# Altium schematic sheet Power Board.DCDC2.SchDoc
size A4; SheetNumber: 2; SheetTotal: 2
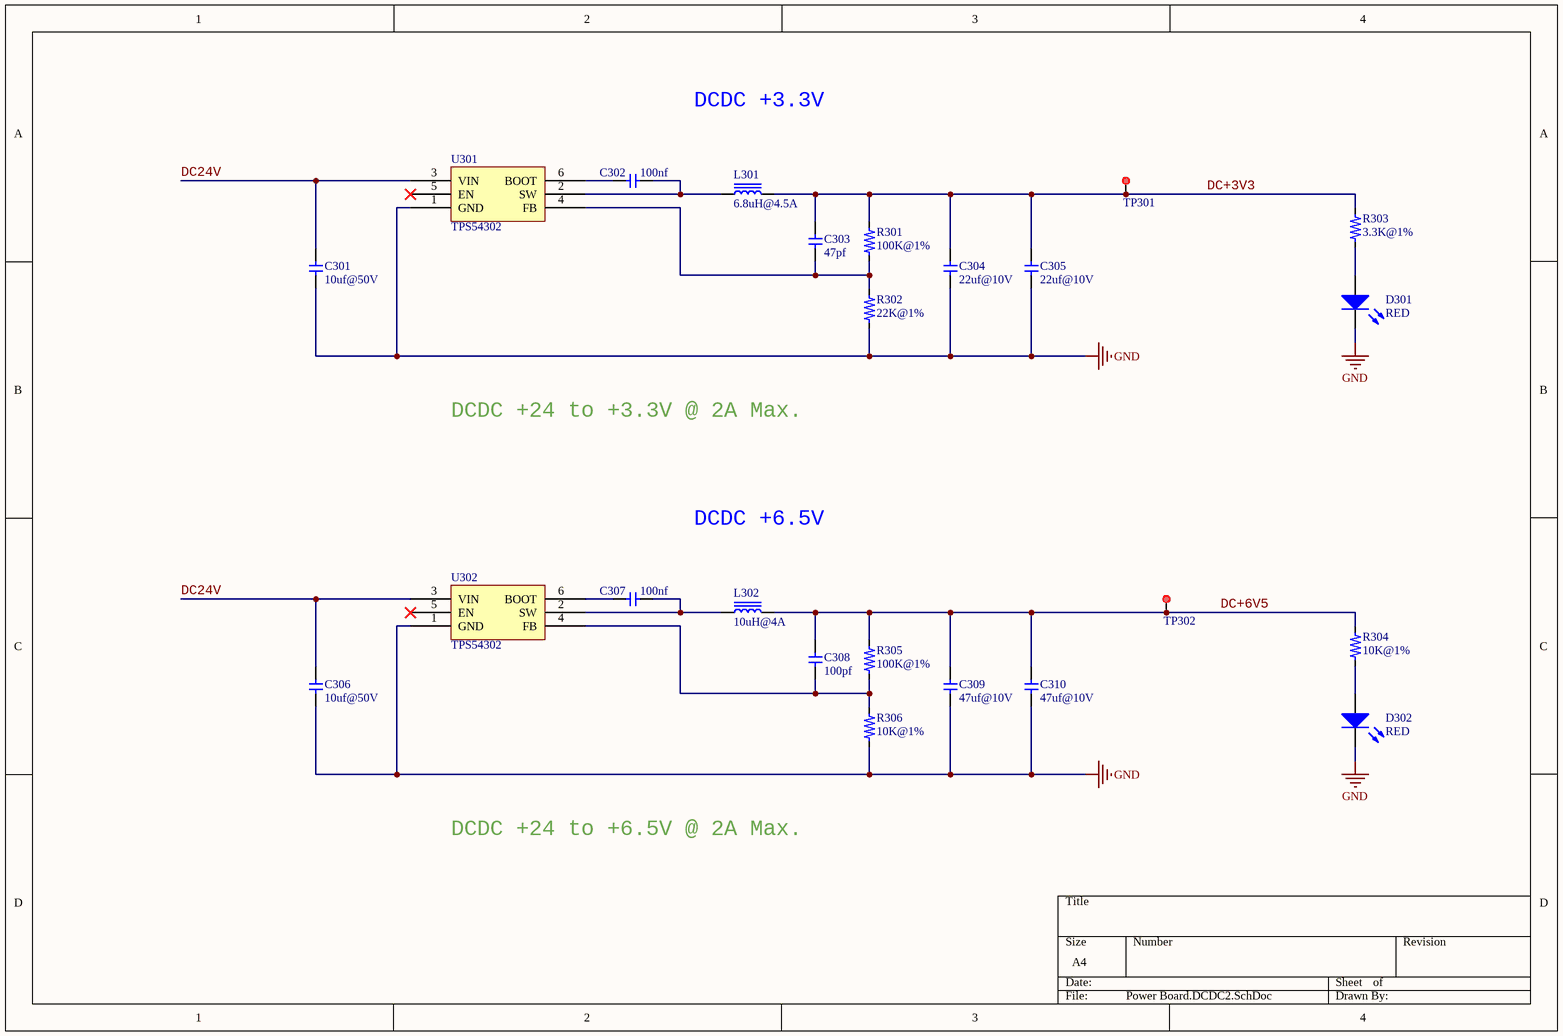
[diagram p0: Power Board.DCDC2.SchDoc]

## Parts
C301  value 10uf@50V  [C1206]  (hidden comment: Cap)
C302  value 100nf  [C0603]  (hidden comment: Cap)
C303  value 47pf  [C0603]  (hidden comment: Cap)
C304  value 22uf@10V  [C1206]  (hidden comment: Cap)
C305  value 22uf@10V  [C1206]  (hidden comment: Cap)
C306  value 10uf@50V  [C1206]  (hidden comment: Cap)
C307  value 100nf  [C0603]  (hidden comment: Cap)
C308  value 100pf  [C0603]  (hidden comment: Cap)
C309  value 47uf@10V  [C1206]  (hidden comment: Cap)
C310  value 47uf@10V  [C1206]  (hidden comment: Cap)
D301  value RED  [LED0603]  (hidden comment: LED)
D302  value RED  [LED0603]  (hidden comment: LED)
L301  value 6.8uH@4.5A  [L06063]  (hidden comment: Inductor Iron)
L302  value 10uH@4A  [L06063]  (hidden comment: Inductor Iron)
R301  value 100K@1%  [R0603]  (hidden comment: Res)
R302  value 22K@1%  [R0603]  (hidden comment: Res)
R303  value 3.3K@1%  [R0603]  (hidden comment: Res)
R304  value 10K@1%  [R0603]  (hidden comment: Res)
R305  value 100K@1%  [R0603]  (hidden comment: Res)
R306  value 10K@1%  [R0603]  (hidden comment: Res)
TP301  TestPoint  [TestPoint-THM1.0-L]  (value not drawn)
TP302  TestPoint  [TestPoint-THM1.0-L]  (value not drawn)
U301  TPS54302  [TPS54302-SOT23-6]
U302  TPS54302  [TPS54302-SOT23-6]

## Nets
GND: C301.1 C304.1 C305.1 C306.1 C309.1 C310.1 D301.2(K) D302.2(K) R302.1 R306.1 U301.1(GND) U302.1(GND)
DC24V: C301.2 C306.2 U301.3(VIN) U302.3(VIN)
DC+3V3: C303.1 C304.2 C305.2 L301.2 R301.2 R303.2 TP301.1
DC+6V5: C308.1 C309.2 C310.2 L302.2 R304.2 R305.2 TP302.1
NetC302_1: C302.1 L301.1 U301.2(SW)
NetC302_2: C302.2 U301.6(BOOT)
NetC303_2: C303.2 R301.1 R302.2 U301.4(FB)
NetC307_1: C307.1 L302.1 U302.2(SW)
NetC307_2: C307.2 U302.6(BOOT)
NetC308_2: C308.2 R305.1 R306.2 U302.4(FB)
NetD301_1: D301.1(A) R303.1
NetD302_1: D302.1(A) R304.1

Not connected (* = marked no-connect by the designer): U301 5(EN)*; U302 5(EN)*

## Notes on the sheet
- DCDC +3.3V
- DCDC +24 to +3.3V @ 2A Max.
- DCDC +6.5V
- DCDC +24 to +6.5V @ 2A Max.

## Library data of the parts
L301 L302 = Inductor Iron: Magnetic-Core Inductor
R301-R306 = Res: 电阻
TP301 TP302 = TestPoint: 测试点
U301 U302 = TPS54302: TPS54302 4.5-V to 28-V Input, 3-A Output, EMI-Friendly Synchronous Step-Down Converter